# Altium schematic sheet Microcontroller.SchDoc: MCU Schematic
size A4; ApprovedBy: Hieu.NDM210345; CheckedBy: Huy.BM213707; Author: Hieu.NDM210345; CompanyName: SANSLAB; Revision: Hieu.NDM210345; SheetNumber: 1; SheetTotal: 2; SPICEModelCacheINFMRJAD: <root> / <DocumentId>INFMRJAD</DocumentId> / <CacheFrame Number="0"> / <Model Name="0805_885382207007_100nf" Kind="CKT"> / <Text>******* / .subckt 0805_885382207007_100nF 1 2 / Rser 1 3 0.0397714465846 / Lser 2 4 9.11116414E-10 / C1 3 4 0.0000001 / Rpar 3 4 5000000000 / .ends 0805_885382207007_100nF</Text> / </Model> / <Model Name="0805_885012007051_10pf" Kind="CKT"> / <Text>******* / .subckt 0805_885012007051_10pF 1 2 / Rser 1 3 0.5317 / Lser 2 4 0.00000000045 / C1 3 4 0.00000000001 / Rpar 3 4 10000000000 / .ends 0805_885012007051_10pF</Text> / </Model> / </CacheFrame> / </root>
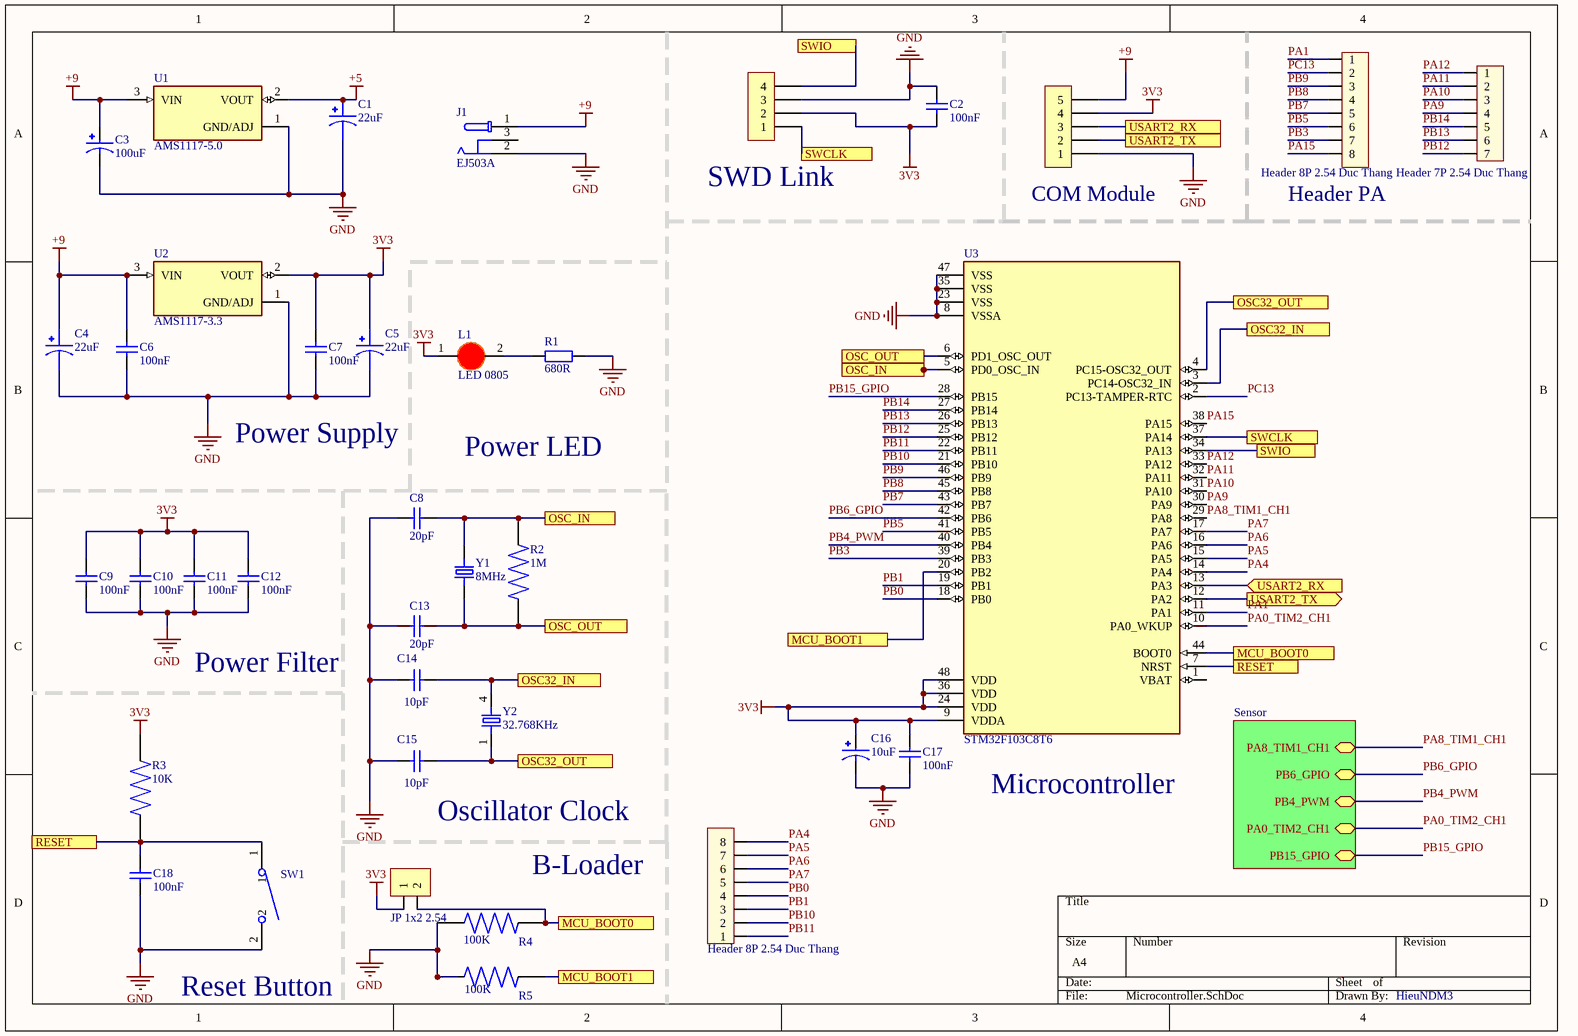
[diagram p0: Microcontroller.SchDoc]

## Parts
C1  22uF  [CAPPRD200W50D550H1250]
C2  100nF  [WCAP-CSST_0805_L2W1.25H1.25]
C3  100uF  [CAPPRD500W60D1000H1250]
C4  22uF  [CAPPRD200W50D550H1250]
C5  22uF  [CAPPRD200W50D550H1250]
C6  100nF  [WCAP-CSST_0805_L2W1.25H1.25]
C7  100nF  [WCAP-CSST_0805_L2W1.25H1.25]
C8  20pF  [tu 0805]
C9  100nF  [WCAP-CSST_0805_L2W1.25H1.25]
C10  100nF  [WCAP-CSST_0805_L2W1.25H1.25]
C11  100nF  [WCAP-CSST_0805_L2W1.25H1.25]
C12  100nF  [WCAP-CSST_0805_L2W1.25H1.25]
C13  20pF  [tu 0805]
C14  10pF  [WCAP-CSGP_0805_L2W1.25H0.6_Reflow]
C15  10pF  [WCAP-CSGP_0805_L2W1.25H0.6_Reflow]
C16  10uF  [CAPMP7343X430N]
C17  100nF  [WCAP-CSST_0805_L2W1.25H1.25]
C18  100nF  [WCAP-CSST_0805_L2W1.25H1.25]
H1  Header 8P 2.54 Duc Thang  [XH2.54M-8]
H2  Header 7P 2.54 Duc Thang  [XH2.54M-7]
H3  (no value)  [Header 4P DC 2.54]
H4  (no value)  [XH2.54M-5]
H5  Header 8P 2.54 Duc Thang  [XH2.54M-8]
J1  EJ503A  [MPD_EJ503A]
JP1  JP 1x2 2.54  [JP 1x2 DT]
L1  LED 0805  [LED-0805-Red]
R1  680R  [Tro SMD 0805]
R2  1M  [RESC2012X65N]
R3  10K  [RESC2012X65N]
R4  100K  [RESC2012X65N]
R5  100K  [RESC2012X65N]
SW1  (no value)  [SW_RS-032G05A3-SMRT]
U1  AMS1117-5.0  [SOT229P700X180-4N]
U2  AMS1117-3.3  [SOT229P700X180-4N]
U3  STM32F103C8T6  [QFP50P900X900X160-48N]
Y1  8MHz  [XTAL_ECS-80-S-4X]
Y2  32.768KHz  [OSCL550P800X320X254-4N]

## Sub-sheets
? = Sensor: PA8_TIM1_CH1 (bidir), PB6_GPIO (bidir), PB4_PWM (bidir), PA0_TIM2_CH1 (bidir), PB15_GPIO (bidir)

## Ports
MCU_BOOT0 (see Sheet1[2D]), MCU_BOOT0 (see Sheet1[4C]), MCU_BOOT1 (see Sheet1[2D]), MCU_BOOT1 (see Sheet1[3C]), OSC32_IN (see Sheet1[2C]), OSC32_IN (see Sheet1[4B]), OSC32_OUT (see Sheet1[2C]), OSC32_OUT (see Sheet1[4B]), OSC_IN (see Sheet1[2C]), OSC_IN (see Sheet1[3B]), OSC_OUT (see Sheet1[2C]), OSC_OUT (see Sheet1[3B]), RESET, RESET (see Sheet1[1D]), SWCLK (see Sheet1[3A]), SWCLK (see Sheet1[4B]), SWIO (see Sheet1[3A]), SWIO (see Sheet1[4B]), USART2_RX, USART2_RX (in), USART2_TX, USART2_TX (out)

## Nets
3V3: C2.1 C5.1 C7.2 C9.2 C10.2 C11.2 C12.2 C16.1 C17.2 H3.2 H4.4 JP1.1 L1.1(A) R3.2 U2.2(VOUT) U3.9(VDDA) U3.24(VDD) U3.36(VDD) U3.48(VDD)
+5: C1.1 U1.2(VOUT)
+9: C3.P C4.1 C6.2 H4.5 J1.1 U1.3(VIN) U2.3(VIN)
GND: C1.2 C2.2 C3.N C4.2 C5.2 C6.1 C7.1 C8.2 C9.1 C10.1 C11.1 C12.1 C13.2 C14.1 C15.1 C16.2 C17.1 C18.1 H3.3 H4.1 J1.2 R1.2 R4.2 R5.2 SW1.2 U1.1(GND/ADJ) U2.1(GND/ADJ) U3.8(VSSA) U3.23(VSS) U3.35(VSS) U3.47(VSS)
MCU_BOOT0: JP1.2 R4.1 U3.44(BOOT0) ; port MCU_BOOT0
MCU_BOOT1: R5.1 U3.20(PB2) ; port MCU_BOOT1
OSC32_IN: C14.2 U3.3(PC14-OSC32_IN) Y2.4 ; port OSC32_IN
OSC32_OUT: C15.2 U3.4(PC15-OSC32_OUT) Y2.1 ; port OSC32_OUT
OSC_IN: C8.1 R2.1 U3.5(PD0_OSC_IN) Y1.2 ; port OSC_IN
OSC_OUT: C13.1 R2.2 U3.6(PD1_OSC_OUT) Y1.1 ; port OSC_OUT
PA0_TIM2_CH1: U3.10(PA0_WKUP) ; sheet /PA0_TIM2_CH1
PA1: H1.1 U3.11(PA1)
PA4: H5.8 U3.14(PA4)
PA5: H5.7 U3.15(PA5)
PA6: H5.6 U3.16(PA6)
PA7: H5.5 U3.17(PA7)
PA8_TIM1_CH1: U3.29(PA8) ; sheet /PA8_TIM1_CH1
PA9: H2.4 U3.30(PA9)
PA10: H2.3 U3.31(PA10)
PA11: H2.2 U3.32(PA11)
PA12: H2.1 U3.33(PA12)
PA15: H1.8 U3.38(PA15)
PB0: H5.4 U3.18(PB0)
PB1: H5.3 U3.19(PB1)
PB3: H1.7 U3.39(PB3)
PB4_PWM: U3.40(PB4) ; sheet /PB4_PWM
PB5: H1.6 U3.41(PB5)
PB6_GPIO: U3.42(PB6) ; sheet /PB6_GPIO
PB7: H1.5 U3.43(PB7)
PB8: H1.4 U3.45(PB8)
PB9: H1.3 U3.46(PB9)
PB10: H5.2 U3.21(PB10)
PB11: H5.1 U3.22(PB11)
PB12: H2.7 U3.25(PB12)
PB13: H2.6 U3.26(PB13)
PB14: H2.5 U3.27(PB14)
PB15_GPIO: U3.28(PB15) ; sheet /PB15_GPIO
PC13: H1.2 U3.2(PC13-TAMPER-RTC)
RESET: C18.2 R3.1 SW1.1 U3.7(NRST) ; port RESET
SWCLK: H3.1 U3.37(PA14) ; port SWCLK
SWIO: H3.4 U3.34(PA13) ; port SWIO
USART2_RX: H4.3 U3.13(PA3) ; port USART2_RX
USART2_TX: H4.2 U3.12(PA2) ; port USART2_TX
NetL1_2: L1.2(K) R1.1

Not connected (* = marked no-connect by the designer): J1 3; U3 1(VBAT)

## Notes on the sheet
- (near H3) SWD Link
- (near H4) COM Module
- (near H1) Header PA
- Power Supply
- Power LED
- Power Filter
- (near C15) Oscillator Clock
- (near U3) Microcontroller
- (near R4) B-Loader
- (near SW1) Reset Button
- HieuNDM3

## Library data of the parts
C1 C4 C5 = UVR1E220MDD: 22ÂµF 25V Aluminum Electrolytic Capacitors Radial, Can 2000 Hrs @ 85Â°C; MF: Nichicon; Value: *; SnapEDA_Link: https://www.snapeda.com/parts/UVR1E220MDD/Nichicon/view-part/2301907/?ref=snap; Purchase-URL: https://pricing.snapeda.com/search/part/UVR1E220MDD/?ref=eda; Price: None; Availability: Good; Package: Radial Nichicon; MP: UVR1E220MDD
C2 C6 C7 C9-C12 C17 C18 = 885382207007: WCAP-CSST Multilayer Ceramic Chip Capacitor, Soft Termination, SMT, size 0805, X7R Class II, 100nF, 50V; Manufacturer: Wurth Elektronik; Case/Size Code: 0805; Capacitance Tolerance: +/-10%; Dissipation Factor: 2.5%; Insulation Resistance: 5GOhm; Technical Reference: X7R0805104K050DFCT1S000; Manufacturer Part Number: 885382207007; Category: Multilayer Ceramic Chip Capacitors; Match Code: WCAP-CSST; ComponentLink1Description: Website Link; ComponentLink1URL: https://www.we-online.com/redexpert/article/885382207007?ad; ComponentLink2Description: Datasheet Link; ComponentLink2URL: https://www.we-online.com/redexpert/spec/885382207007?ad; Mount: Surface Mount; Operating Temperature Max: 125°C; Operating Temperature Min: -55°C; Packaging: Tape and Reel; Length: 2mm; Width: 1.25mm; Height: 1.25mm; Capacitance: 100nF; Ceramic Type: X7R Class II; Rated Voltage (DC): 50V
C3 = EEUTA1V101: CAP ALUM 100UF 20% 35V RADIAL; MF: Panasonic; Package: RADIAL-2 Panasonic; Price: None; Availability: In Stock; Check_prices: https://www.snapeda.com/parts/EEUTA1V101/Panasonic/view-part/5783936/?ref=eda; MP: EEUTA1V101; SnapEDA_Link: https://www.snapeda.com/parts/EEUTA1V101/Panasonic/view-part/5783936/?ref=snap; Value: *
C8 C13 = Tu 0805 20pF 50V 10%: Dán; Don_Vi: Con; Ten_Linh_Kien: Tụ 0805 20P 10% 50V; So_Chan: 2; Ma_Hang: MH004558; Chung_Loai: Dán; Kieu_Chan: *
C14 C15 = 885012007051: WCAP-CSGP Multilayer Ceramic Chip Capacitor, General Purpose, size 0805, NP0, 10pF, 50V; Manufacturer: Wurth Elektronik; Case/Size Code: 0805; Capacitance Tolerance: +/-5%; Insulation Resistance: 10GΩ; Q Factor: 600; Technical Reference: NP00805100J050DFCT10000; Manufacturer Part Number: 885012007051; Category: Multilayer Ceramic Chip Capacitors; Match Code: WCAP-CSGP; ComponentLink1Description: Website Link; ComponentLink1URL: https://www.we-online.com/redexpert/article/885012007051?ad; ComponentLink2Description: Datasheet Link; ComponentLink2URL: https://www.we-online.com/redexpert/spec/885012007051?ad; Mount: Surface Mount; Min Operating Temperature: -55°C; Max Operating Temperature: 125°C; Packaging: Tape and Reel; Length: 2mm; Width: 1.25mm; Height: 0.6mm; Capacitance: 10pF; Ceramic Type: NP0; Rated Voltage (DC): 50V
C16 = T493X106K035AK6120: Tantalum Capacitors - Solid SMD T493_COTS, Tantalum, MnO2 Tantalum, COTS, 10 uF, 10%, 35 VDC, SMD, MnO2, Molded, COTS, N/A, 250 mOhms, 7343, Height Max = 4.3mm; MF: Kemet; SnapEDA_Link: https://www.snapeda.com/parts/T493X106K035AK6120/Kemet/view-part/?ref=snap; Package: SMD-2 Kemet; Value: *; MP: T493X106K035AK6120; Check_prices: https://www.snapeda.com/parts/T493X106K035AK6120/Kemet/view-part/?ref=eda
H1 H5 = Header 8P 2.54 Duc Thang: Cắm; Ten_Linh_Kien: Header 8P XH2.54-8P Đực Thẳng; Don_Vi: Con; Ma_Hang: MH003366; Chung_Loai: Cắm
H2 = Header 7P 2.54 Duc Thang: Cắm; Ten_Linh_Kien: Header 7P XH2.54-7P Đực Thẳng; Don_Vi: Con; Ma_Hang: MH003369; Chung_Loai: Cắm
H3 = Header 4P 2.54 Duc Cong: Cắm; Ten_Linh_Kien: Header 4P XH2.54-4P Đực Cong; Don_Vi: Con; Ma_Hang: MH001310; Chung_Loai: Cắm
H4 = Header 5P 2.54 Duc Thang: Cắm; Ten_Linh_Kien: Header 5P XH2.54-5P Đực Thẳng; Don_Vi: Con; Ma_Hang: MH001298; Chung_Loai: Cắm
J1 = EJ503A: Power Barrel Connector Jack 2.10mm ID (0.083), 5.50mm OD (0.217) Through Hole, Right Angle; MF: MPD; Package: None; Price: None; Check_prices: https://www.snapeda.com/parts/EJ503A/MPD+%2528Memory+Protection+Devices%2529/view-part/?ref=eda; Value: *; SnapEDA_Link: https://www.snapeda.com/parts/EJ503A/MPD+%2528Memory+Protection+Devices%2529/view-part/?ref=snap; MP: EJ503A; Availability: In Stock; Purchase-URL: https://pricing.snapeda.com/search?q=EJ503A&ref=eda
JP1 = JP 1x2 2.54 Duc Thang: Cắm; Ten_Linh_Kien: Jump Đơn Đực 2.54MM 1x40P Thẳng 11MM; Don_Vi: Con; Ma_Hang: MH000903; Ghi_Chu: *; Kieu_Chan: *; Chung_Loai: Cắm
L1 = LED 0805 Do: Dán; Don_Vi: Con; Ma_Hang: MH000897; Ten_Linh_Kien: LED 0805 Màu Đỏ (Red); Ghi_Chu: *; Kieu_Chan: *; Chung_Loai: Dán
R1 = Tro 0805 5% 680R: Dán; Don_Vi: Con; Ma_Hang: MH005344; So_Chan: 2; Ten_Linh_Kien: Trở 0805 5% 680R; Chung_Loai: Dán; Kieu_Chan: *
R2 = RP73D2A1M0BTDF: Res Thin Film 0805 1M Ohm 0.1% 0.125W(1/8W) Â±15ppm/C Epoxy Pad SMD T/R; Package: None; Price: None; Value: *; MP: RP73D2A1M0BTDF; Availability: Unavailable
R3-R5 = RMCF0805FT10K0: MF: {'manufacturer': u'Stackpole Electronics Inc'}; Package: None; Price: None; Value: *; MP: RMCF0805FT10K0; Availability: Unavailable
SW1 = RS-032G05A3-SMRT: Tactile Switch SPST-NO Top Actuated Surface Mount; MF: C&K; MP: RS032G05A3SMRT; Package: None; Value: *; Availability: Unavailable; SnapEDA_Link: https://www.snapeda.com/parts/RS032G05A3SMRT/C%26K/view-part/578384/?ref=snap; Price: None
U1 = AMS1117-5.0: 1A LOW DROPOUT VOLTAGE REGULATOR; MF: ams; MP: AMS1117-5.0; Package: SOT-223 Seeed Technology; SnapEDA_Link: https://www.snapeda.com/parts/AMS1117-5.0/ams/view-part/?ref=snap; Check_prices: https://www.snapeda.com/parts/AMS1117-5.0/ams/view-part/?ref=eda; Availability: Not in stock; Value: *; Price: None
U2 = AMS1117-3.3: Sot223/Pkg 1-Amp 3.3-Volt Low Drop Out Voltage Regulatator; MF: Advanced Monolithic Systems; Package: SOT-223 Seeed Technology; Value: *; Check_prices: https://www.snapeda.com/parts/AMS1117-3.3/Advanced+Monolithic+Systems/view-part/?ref=eda; Price: None; Availability: Not in stock; MP: AMS1117-3.3; SnapEDA_Link: https://www.snapeda.com/parts/AMS1117-3.3/Advanced+Monolithic+Systems/view-part/?ref=snap
U3 = STM32F103C8T6: ARM® Cortex®-M3 STM32F1 Microcontroller IC 32-Bit 72MHz 64KB (64K x 8) FLASH 48-LQFP (7x7); MF: STMicroelectronics; SnapEDA_Link: https://www.snapeda.com/parts/STM32F103C8T6/STMicroelectronics/view-part/?ref=snap; Package: LQFP-48 STMicroelectronics; Value: *; MP: STM32F103C8T6; Check_prices: https://www.snapeda.com/parts/STM32F103C8T6/STMicroelectronics/view-part/?ref=eda
Y1 = ECS-80-S-4X: CRYSTAL T/H; Package: None; Price: None; Value: *; MP: ECS-80-S-4X; Availability: Unavailable
Y2 = MC-306_32.7680K-A5:_ROHS: 32.768kHz Â±100ppm Crystal 12.5pF 50 kOhms 4-SOJ, 5.50mm pitch; MP: MC-306 32.7680K-A5: ROHS; MF: EPSON; Price: None; Availability: Unavailable; Package: 4-4 Epson; SnapEDA_Link: https://www.snapeda.com/parts/MC-306%2032.7680K-A5%3A%20ROHS/EPSON/view-part/620500/?ref=snap; Value: *